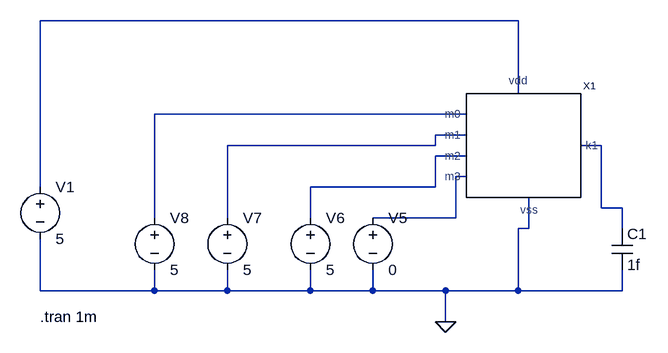
[diagram p0: schematic testbench-dmux.asc]
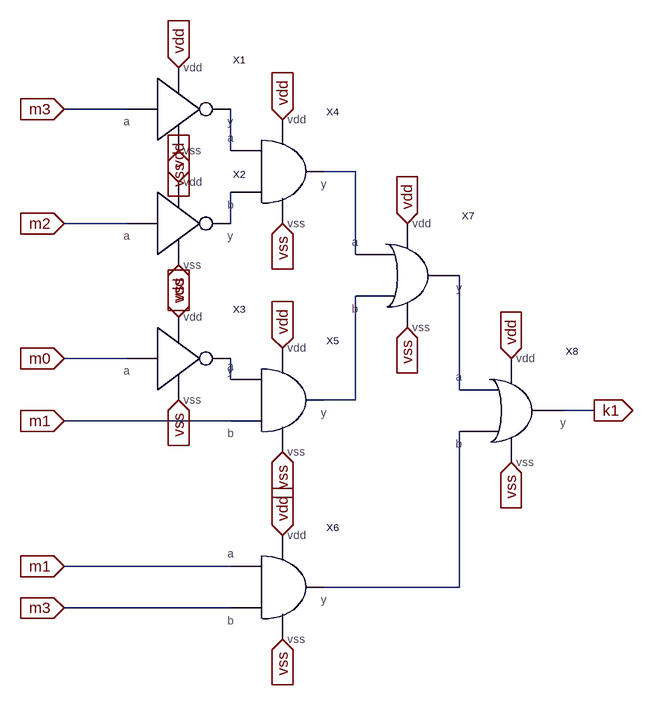
[diagram p1: sub-circuit m_key.asc]
testbench-dmux.asc, the LTspice schematic file:
Version 4
SHEET 1 968 680
WIRE 192 -112 -544 -112
WIRE 192 0 192 -112
WIRE 112 32 -368 32
WIRE 112 64 64 64
WIRE 64 80 64 64
WIRE 64 80 -256 80
WIRE 320 80 288 80
WIRE 112 96 64 96
WIRE 112 128 96 128
WIRE -544 144 -544 -112
WIRE 64 144 64 96
WIRE 64 144 -128 144
WIRE 320 176 320 80
WIRE 352 176 320 176
WIRE -368 192 -368 32
WIRE -256 192 -256 80
WIRE -128 192 -128 144
WIRE 96 192 96 128
WIRE 96 192 -32 192
WIRE 208 208 208 160
WIRE 208 208 192 208
WIRE 352 208 352 176
WIRE -544 304 -544 224
WIRE -368 304 -368 272
WIRE -368 304 -544 304
WIRE -256 304 -256 272
WIRE -256 304 -368 304
WIRE -128 304 -128 272
WIRE -128 304 -256 304
WIRE -32 304 -32 272
WIRE -32 304 -128 304
WIRE 80 304 -32 304
WIRE 192 304 192 208
WIRE 192 304 80 304
WIRE 352 304 352 272
WIRE 352 304 192 304
WIRE 80 352 80 304
FLAG 80 352 0
SYMBOL voltage -544 128 R0
WINDOW 123 0 0 Left 0
WINDOW 39 0 0 Left 0
SYMATTR InstName V1
SYMATTR Value 5
SYMBOL cap 336 208 R0
SYMATTR InstName C1
SYMATTR Value 1f
SYMBOL voltage -32 176 R0
WINDOW 123 0 0 Left 0
WINDOW 39 0 0 Left 0
SYMATTR InstName V5
SYMATTR Value 0
SYMBOL voltage -128 176 R0
WINDOW 123 0 0 Left 0
WINDOW 39 0 0 Left 0
SYMATTR InstName V6
SYMATTR Value 5
SYMBOL voltage -256 176 R0
WINDOW 123 0 0 Left 0
WINDOW 39 0 0 Left 0
SYMATTR InstName V7
SYMATTR Value 5
SYMBOL voltage -368 176 R0
WINDOW 123 0 0 Left 0
WINDOW 39 0 0 Left 0
SYMATTR InstName V8
SYMATTR Value 5
SYMBOL m_key 176 80 R0
SYMATTR InstName X1
TEXT -544 344 Left 2 !.tran 1m

m_key.asc, the sub-circuit schematic file:
Version 4
SHEET 1 904 824
WIRE 96 -64 0 -64
WIRE 256 0 256 -64
WIRE 448 32 400 32
WIRE 96 112 0 112
WIRE 256 112 256 64
WIRE 448 160 448 32
WIRE 96 320 0 320
WIRE 256 352 256 320
WIRE 608 368 608 192
WIRE 448 384 448 224
WIRE 448 384 400 384
WIRE 816 400 768 400
WIRE 256 416 0 416
WIRE 256 640 0 640
WIRE 608 672 608 432
WIRE 608 672 400 672
WIRE 256 704 0 704
FLAG 176 -128 vdd
IOPIN 176 -128 In
FLAG 336 -48 vdd
IOPIN 336 -48 In
FLAG 176 256 vdd
IOPIN 176 256 In
FLAG 336 304 vdd
IOPIN 336 304 In
FLAG 336 592 vdd
IOPIN 336 592 In
FLAG 688 320 vdd
IOPIN 688 320 In
FLAG 176 0 vss
IOPIN 176 0 In
FLAG 176 176 vss
IOPIN 176 176 In
FLAG 336 112 vss
IOPIN 336 112 In
FLAG 336 464 vss
IOPIN 336 464 In
FLAG 336 752 vss
IOPIN 336 752 In
FLAG 688 480 vss
IOPIN 688 480 In
FLAG 0 -64 m3
IOPIN 0 -64 In
FLAG 0 112 m2
IOPIN 0 112 In
FLAG 0 320 m0
IOPIN 0 320 In
FLAG 0 416 m1
IOPIN 0 416 In
FLAG 0 640 m1
IOPIN 0 640 In
FLAG 0 704 m3
IOPIN 0 704 In
FLAG 816 400 k1
IOPIN 816 400 Out
FLAG 176 48 vdd
IOPIN 176 48 In
FLAG 528 272 vss
IOPIN 528 272 In
FLAG 528 112 vdd
IOPIN 528 112 In
FLAG 176 384 vss
IOPIN 176 384 In
SYMBOL not 176 -64 R0
SYMATTR InstName X1
SYMBOL not 176 112 R0
SYMATTR InstName X2
SYMBOL not 176 320 R0
SYMATTR InstName X3
SYMBOL and 336 32 R0
SYMATTR InstName X4
SYMBOL and 336 384 R0
SYMATTR InstName X5
SYMBOL and 336 672 R0
SYMATTR InstName X6
SYMBOL or 528 192 R0
SYMATTR InstName X7
SYMBOL or 688 400 R0
SYMATTR InstName X8

The netlist it stands for:
* testbench-dmux.asc
V1 N001 0 5
C1 N004 0 1f
V5 N006 0 0
V6 N005 0 5
V7 N003 0 5
V8 N002 0 5
XX1 N002 N003 N005 N006 N001 0 N004 m_key

* block symbol definitions
.subckt m_key m0 m1 m2 m3 vdd vss k1
XX1 m3 N001 vdd vss not  ; pins a y vdd vss
XX2 m2 N003 vdd vss not  ; pins a y vdd vss
XX3 m0 N004 vdd vss not  ; pins a y vdd vss
XX4 N001 N003 N002 vdd vss and  ; pins a b y vdd vss
XX5 N004 m1 N006 vdd vss and  ; pins a b y vdd vss
XX6 m1 m3 N007 vdd vss and  ; pins a b y vdd vss
XX7 N002 N006 N005 vdd vss or  ; pins a b y vdd vss
XX8 N005 N007 k1 vdd vss or  ; pins a b y vdd vss
.ends m_key

.tran 1m
.backanno
.end